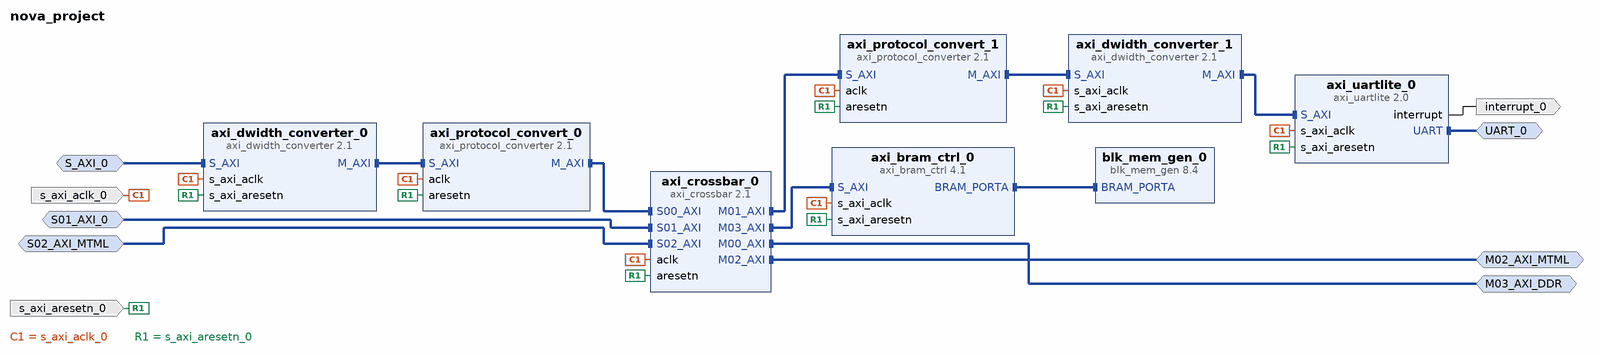
[diagram p0: block diagram of the top level]
# Vivado block design nova_project, xcvu9p-flga2104-1-e, Vivado 2021.1
create_bd_design nova_project

create_bd_intf_port -mode Slave -vlnv xilinx.com:interface:aximm_rtl:1.0 S_AXI_0
set_property -dict [list \
  CONFIG.ADDR_WIDTH 64 \
  CONFIG.ARUSER_WIDTH 0 \
  CONFIG.AWUSER_WIDTH 0 \
  CONFIG.BUSER_WIDTH 0 \
  CONFIG.DATA_WIDTH 32 \
  CONFIG.FREQ_HZ 10000000 \
  CONFIG.HAS_BRESP 1 \
  CONFIG.HAS_BURST 1 \
  CONFIG.HAS_CACHE 1 \
  CONFIG.HAS_LOCK 1 \
  CONFIG.HAS_PROT 1 \
  CONFIG.HAS_QOS 1 \
  CONFIG.HAS_REGION 1 \
  CONFIG.HAS_RRESP 1 \
  CONFIG.HAS_WSTRB 1 \
  CONFIG.ID_WIDTH 0 \
  CONFIG.MAX_BURST_LENGTH 1 \
  CONFIG.NUM_READ_OUTSTANDING 2 \
  CONFIG.NUM_READ_THREADS 1 \
  CONFIG.NUM_WRITE_OUTSTANDING 2 \
  CONFIG.NUM_WRITE_THREADS 1 \
  CONFIG.PROTOCOL AXI4LITE \
  CONFIG.READ_WRITE_MODE READ_WRITE \
  CONFIG.RUSER_BITS_PER_BYTE 0 \
  CONFIG.RUSER_WIDTH 0 \
  CONFIG.SUPPORTS_NARROW_BURST 0 \
  CONFIG.WUSER_BITS_PER_BYTE 0 \
  CONFIG.WUSER_WIDTH 0 \
] [get_bd_intf_ports S_AXI_0]
create_bd_intf_port -mode Slave -vlnv xilinx.com:interface:aximm_rtl:1.0 S01_AXI_0
set_property -dict [list \
  CONFIG.ADDR_WIDTH 64 \
  CONFIG.ARUSER_WIDTH 0 \
  CONFIG.AWUSER_WIDTH 0 \
  CONFIG.BUSER_WIDTH 0 \
  CONFIG.DATA_WIDTH 64 \
  CONFIG.FREQ_HZ 10000000 \
  CONFIG.HAS_BRESP 1 \
  CONFIG.HAS_BURST 1 \
  CONFIG.HAS_CACHE 1 \
  CONFIG.HAS_LOCK 1 \
  CONFIG.HAS_PROT 1 \
  CONFIG.HAS_QOS 1 \
  CONFIG.HAS_REGION 0 \
  CONFIG.HAS_RRESP 1 \
  CONFIG.HAS_WSTRB 1 \
  CONFIG.ID_WIDTH 2 \
  CONFIG.MAX_BURST_LENGTH 256 \
  CONFIG.NUM_READ_OUTSTANDING 2 \
  CONFIG.NUM_READ_THREADS 1 \
  CONFIG.NUM_WRITE_OUTSTANDING 2 \
  CONFIG.NUM_WRITE_THREADS 1 \
  CONFIG.PROTOCOL AXI4 \
  CONFIG.READ_WRITE_MODE READ_WRITE \
  CONFIG.RUSER_BITS_PER_BYTE 0 \
  CONFIG.RUSER_WIDTH 0 \
  CONFIG.SUPPORTS_NARROW_BURST 1 \
  CONFIG.WUSER_BITS_PER_BYTE 0 \
  CONFIG.WUSER_WIDTH 0 \
] [get_bd_intf_ports S01_AXI_0]
create_bd_intf_port -mode Slave -vlnv xilinx.com:interface:aximm_rtl:1.0 S02_AXI_MTML
set_property -dict [list \
  CONFIG.ADDR_WIDTH 64 \
  CONFIG.ARUSER_WIDTH 0 \
  CONFIG.AWUSER_WIDTH 0 \
  CONFIG.BUSER_WIDTH 0 \
  CONFIG.DATA_WIDTH 64 \
  CONFIG.FREQ_HZ 10000000 \
  CONFIG.HAS_BRESP 1 \
  CONFIG.HAS_BURST 1 \
  CONFIG.HAS_CACHE 1 \
  CONFIG.HAS_LOCK 1 \
  CONFIG.HAS_PROT 1 \
  CONFIG.HAS_QOS 1 \
  CONFIG.HAS_REGION 0 \
  CONFIG.HAS_RRESP 1 \
  CONFIG.HAS_WSTRB 1 \
  CONFIG.ID_WIDTH 5 \
  CONFIG.MAX_BURST_LENGTH 256 \
  CONFIG.NUM_READ_OUTSTANDING 2 \
  CONFIG.NUM_READ_THREADS 1 \
  CONFIG.NUM_WRITE_OUTSTANDING 2 \
  CONFIG.NUM_WRITE_THREADS 1 \
  CONFIG.PROTOCOL AXI4 \
  CONFIG.READ_WRITE_MODE READ_WRITE \
  CONFIG.RUSER_BITS_PER_BYTE 0 \
  CONFIG.RUSER_WIDTH 0 \
  CONFIG.SUPPORTS_NARROW_BURST 1 \
  CONFIG.WUSER_BITS_PER_BYTE 0 \
  CONFIG.WUSER_WIDTH 0 \
] [get_bd_intf_ports S02_AXI_MTML]
create_bd_intf_port -mode Master -vlnv xilinx.com:interface:aximm_rtl:1.0 M02_AXI_MTML
set_property -dict [list \
  CONFIG.ADDR_WIDTH 64 \
  CONFIG.DATA_WIDTH 64 \
  CONFIG.FREQ_HZ 10000000 \
  CONFIG.NUM_READ_OUTSTANDING 2 \
  CONFIG.NUM_WRITE_OUTSTANDING 2 \
  CONFIG.PROTOCOL AXI4 \
] [get_bd_intf_ports M02_AXI_MTML]
create_bd_intf_port -mode Master -vlnv xilinx.com:interface:aximm_rtl:1.0 M03_AXI_DDR
set_property -dict [list \
  CONFIG.ADDR_WIDTH 64 \
  CONFIG.DATA_WIDTH 64 \
  CONFIG.FREQ_HZ 10000000 \
  CONFIG.NUM_READ_OUTSTANDING 2 \
  CONFIG.NUM_WRITE_OUTSTANDING 2 \
  CONFIG.PROTOCOL AXI4 \
] [get_bd_intf_ports M03_AXI_DDR]
create_bd_intf_port -mode Master -vlnv xilinx.com:interface:uart_rtl:1.0 UART_0
create_bd_port -dir I -type clk s_axi_aclk_0
set_property -dict {CONFIG.FREQ_HZ 10000000} [get_bd_ports s_axi_aclk_0]
create_bd_port -dir I -type rst s_axi_aresetn_0
create_bd_port -dir O -type intr interrupt_0

create_bd_cell -type ip -vlnv xilinx.com:ip:axi_dwidth_converter:2.1 axi_dwidth_converter_0
set_property -dict {CONFIG.ADDR_WIDTH 64 CONFIG.PROTOCOL AXI4LITE CONFIG.SI_DATA_WIDTH 32} [get_bd_cells axi_dwidth_converter_0]
create_bd_cell -type ip -vlnv xilinx.com:ip:axi_protocol_converter:2.1 axi_protocol_convert_0
set_property -dict [list \
  CONFIG.ADDR_WIDTH 64 \
  CONFIG.DATA_WIDTH 64 \
  CONFIG.MI_PROTOCOL AXI4 \
  CONFIG.SI_PROTOCOL AXI4LITE \
  CONFIG.TRANSLATION_MODE 2 \
] [get_bd_cells axi_protocol_convert_0]
create_bd_cell -type ip -vlnv xilinx.com:ip:axi_bram_ctrl:4.1 axi_bram_ctrl_0
set_property -dict {CONFIG.DATA_WIDTH 64 CONFIG.SINGLE_PORT_BRAM 1} [get_bd_cells axi_bram_ctrl_0]
create_bd_cell -type ip -vlnv xilinx.com:ip:blk_mem_gen:8.4 blk_mem_gen_0
set_property -dict [list \
  CONFIG.EN_SAFETY_CKT true \
  CONFIG.Enable_32bit_Address true \
  CONFIG.Read_Width_A 64 \
  CONFIG.Register_PortA_Output_of_Memory_Primitives false \
  CONFIG.Use_RSTA_Pin true \
  CONFIG.Write_Width_A 64 \
  CONFIG.use_bram_block BRAM_Controller \
] [get_bd_cells blk_mem_gen_0]
create_bd_cell -type ip -vlnv xilinx.com:ip:axi_crossbar:2.1 axi_crossbar_0
set_property -dict [list \
  CONFIG.ADDR_RANGES 1 \
  CONFIG.ADDR_WIDTH 64 \
  CONFIG.DATA_WIDTH 64 \
  CONFIG.ID_WIDTH 5 \
  CONFIG.M00_A00_ADDR_WIDTH 26 \
  CONFIG.M00_A00_BASE_ADDR 0x0000000080000000 \
  CONFIG.M01_A00_ADDR_WIDTH 26 \
  CONFIG.M01_A00_BASE_ADDR 0x0000000088000000 \
  CONFIG.M01_S02_READ_CONNECTIVITY 1 \
  CONFIG.M01_S02_WRITE_CONNECTIVITY 1 \
  CONFIG.M02_A00_ADDR_WIDTH 26 \
  CONFIG.M02_A00_BASE_ADDR 0x0000000084000000 \
  CONFIG.M02_S00_READ_CONNECTIVITY 1 \
  CONFIG.M02_S00_WRITE_CONNECTIVITY 1 \
  CONFIG.M02_S02_READ_CONNECTIVITY 1 \
  CONFIG.M02_S02_WRITE_CONNECTIVITY 1 \
  CONFIG.M03_A00_ADDR_WIDTH 26 \
  CONFIG.M03_A00_BASE_ADDR 0x000000008C000000 \
  CONFIG.M03_S02_READ_CONNECTIVITY 1 \
  CONFIG.M03_S02_WRITE_CONNECTIVITY 1 \
  CONFIG.NUM_MI 4 \
  CONFIG.NUM_SI 3 \
  CONFIG.S01_BASE_ID 0x00000008 \
  CONFIG.S02_BASE_ID 0x00000010 \
  CONFIG.S03_BASE_ID 0x00000018 \
  CONFIG.S04_BASE_ID 0x00000020 \
  CONFIG.S05_BASE_ID 0x00000028 \
  CONFIG.S06_BASE_ID 0x00000030 \
  CONFIG.S07_BASE_ID 0x00000038 \
  CONFIG.S08_BASE_ID 0x00000040 \
  CONFIG.S09_BASE_ID 0x00000048 \
  CONFIG.S10_BASE_ID 0x00000050 \
  CONFIG.S11_BASE_ID 0x00000058 \
  CONFIG.S12_BASE_ID 0x00000060 \
  CONFIG.S13_BASE_ID 0x00000068 \
  CONFIG.S14_BASE_ID 0x00000070 \
  CONFIG.S15_BASE_ID 0x00000078 \
] [get_bd_cells axi_crossbar_0]
create_bd_cell -type ip -vlnv xilinx.com:ip:axi_uartlite:2.0 axi_uartlite_0
create_bd_cell -type ip -vlnv xilinx.com:ip:axi_protocol_converter:2.1 axi_protocol_convert_1
set_property -dict {CONFIG.ADDR_WIDTH 64 CONFIG.DATA_WIDTH 64 CONFIG.ID_WIDTH 5} [get_bd_cells axi_protocol_convert_1]
create_bd_cell -type ip -vlnv xilinx.com:ip:axi_dwidth_converter:2.1 axi_dwidth_converter_1
set_property -dict {CONFIG.ADDR_WIDTH 64 CONFIG.PROTOCOL AXI4LITE CONFIG.SI_DATA_WIDTH 64} [get_bd_cells axi_dwidth_converter_1]

# ---- connections ----

connect_bd_intf_net -intf_net S01_AXI_0_1 [get_bd_intf_ports S01_AXI_0] [get_bd_intf_pins axi_crossbar_0/S01_AXI]
connect_bd_intf_net -intf_net S02_AXI_0_1 [get_bd_intf_ports S02_AXI_MTML] [get_bd_intf_pins axi_crossbar_0/S02_AXI]
connect_bd_intf_net -intf_net S_AXI_0_1 [get_bd_intf_ports S_AXI_0] [get_bd_intf_pins axi_dwidth_converter_0/S_AXI]
connect_bd_intf_net [get_bd_intf_pins axi_bram_ctrl_0/BRAM_PORTA] [get_bd_intf_pins blk_mem_gen_0/BRAM_PORTA]
connect_bd_intf_net [get_bd_intf_ports M03_AXI_DDR] [get_bd_intf_pins axi_crossbar_0/M00_AXI]
connect_bd_intf_net [get_bd_intf_pins axi_crossbar_0/M01_AXI] [get_bd_intf_pins axi_protocol_convert_1/S_AXI]
connect_bd_intf_net [get_bd_intf_ports M02_AXI_MTML] [get_bd_intf_pins axi_crossbar_0/M02_AXI]
connect_bd_intf_net [get_bd_intf_pins axi_crossbar_0/M03_AXI] [get_bd_intf_pins axi_bram_ctrl_0/S_AXI]
connect_bd_intf_net [get_bd_intf_pins axi_dwidth_converter_0/M_AXI] [get_bd_intf_pins axi_protocol_convert_0/S_AXI]
connect_bd_intf_net [get_bd_intf_pins axi_dwidth_converter_1/M_AXI] [get_bd_intf_pins axi_uartlite_0/S_AXI]
connect_bd_intf_net [get_bd_intf_pins axi_protocol_convert_0/M_AXI] [get_bd_intf_pins axi_crossbar_0/S00_AXI]
connect_bd_intf_net [get_bd_intf_pins axi_protocol_convert_1/M_AXI] [get_bd_intf_pins axi_dwidth_converter_1/S_AXI]
connect_bd_intf_net [get_bd_intf_ports UART_0] [get_bd_intf_pins axi_uartlite_0/UART]
connect_bd_net [get_bd_pins axi_uartlite_0/interrupt] [get_bd_ports interrupt_0]
connect_bd_net -net s_axi_aclk_0_1 [get_bd_ports s_axi_aclk_0] \
  [get_bd_pins axi_dwidth_converter_0/s_axi_aclk] [get_bd_pins axi_protocol_convert_0/aclk] \
  [get_bd_pins axi_bram_ctrl_0/s_axi_aclk] [get_bd_pins axi_protocol_convert_1/aclk] \
  [get_bd_pins axi_dwidth_converter_1/s_axi_aclk] [get_bd_pins axi_uartlite_0/s_axi_aclk] [get_bd_pins axi_crossbar_0/aclk]
connect_bd_net -net s_axi_aresetn_0_1 [get_bd_ports s_axi_aresetn_0] \
  [get_bd_pins axi_dwidth_converter_0/s_axi_aresetn] [get_bd_pins axi_protocol_convert_0/aresetn] \
  [get_bd_pins axi_bram_ctrl_0/s_axi_aresetn] [get_bd_pins axi_protocol_convert_1/aresetn] \
  [get_bd_pins axi_dwidth_converter_1/s_axi_aresetn] [get_bd_pins axi_uartlite_0/s_axi_aresetn] \
  [get_bd_pins axi_crossbar_0/aresetn]

# ---- address map ----
assign_bd_address -offset 0x0000000080100000 -range 1K -target_address_space [get_bd_addr_spaces S01_AXI_0] [get_bd_addr_segs axi_uartlite_0/S_AXI/Reg]
assign_bd_address -offset 0x0000000080180000 -range 1M -target_address_space [get_bd_addr_spaces S01_AXI_0] [get_bd_addr_segs axi_bram_ctrl_0/S_AXI/Mem0]
assign_bd_address -offset 0x0000000080400000 -range 64K -target_address_space [get_bd_addr_spaces S01_AXI_0] [get_bd_addr_segs M02_AXI_MTML/Reg]
assign_bd_address -offset 0x0000000080600000 -range 1M -target_address_space [get_bd_addr_spaces S01_AXI_0] [get_bd_addr_segs M03_AXI_DDR/Reg]
assign_bd_address -offset 0x0000000080100000 -range 1K -target_address_space [get_bd_addr_spaces S02_AXI_MTML] [get_bd_addr_segs axi_uartlite_0/S_AXI/Reg]
assign_bd_address -offset 0x0000000080180000 -range 1M -target_address_space [get_bd_addr_spaces S02_AXI_MTML] [get_bd_addr_segs axi_bram_ctrl_0/S_AXI/Mem0]
assign_bd_address -offset 0x0000000080400000 -range 64K -target_address_space [get_bd_addr_spaces S02_AXI_MTML] [get_bd_addr_segs M02_AXI_MTML/Reg]
assign_bd_address -offset 0x0000000080600000 -range 1M -target_address_space [get_bd_addr_spaces S02_AXI_MTML] [get_bd_addr_segs M03_AXI_DDR/Reg]
assign_bd_address -offset 0x0000000080100000 -range 1K -target_address_space [get_bd_addr_spaces S_AXI_0] [get_bd_addr_segs axi_uartlite_0/S_AXI/Reg]
assign_bd_address -offset 0x0000000080180000 -range 1M -target_address_space [get_bd_addr_spaces S_AXI_0] [get_bd_addr_segs axi_bram_ctrl_0/S_AXI/Mem0]

validate_bd_design
save_bd_design
